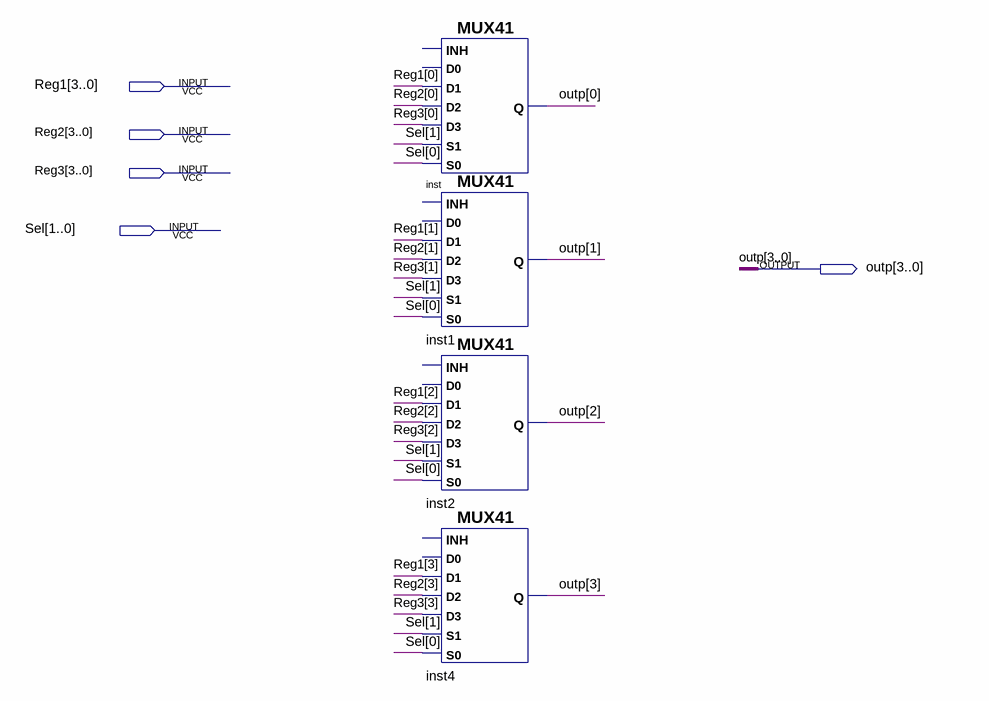
[diagram p0: schematic sheet]
// Quartus schematic mux.bdf as structural Verilog: 4 symbols, 5 pins
module mux (
  input  [3:0] Reg1,
  input  [3:0] Reg2,
  input  [3:0] Reg3,
  input  [1:0] Sel,
  output [3:0] outp
);

  MUX41 inst (.S0(Sel[0]), .D2(Reg2[0]), .S1(Sel[1]), .D3(Reg3[0]), .D1(Reg1[0]), .Q(outp[0]));  // open: D0, INH
  MUX41 inst1 (.S0(Sel[0]), .D2(Reg2[1]), .S1(Sel[1]), .D3(Reg3[1]), .D1(Reg1[1]), .Q(outp[1]));  // open: D0, INH
  MUX41 inst2 (.S0(Sel[0]), .D2(Reg2[2]), .S1(Sel[1]), .D3(Reg3[2]), .D1(Reg1[2]), .Q(outp[2]));  // open: D0, INH
  MUX41 inst4 (.S0(Sel[0]), .D2(Reg2[3]), .S1(Sel[1]), .D3(Reg3[3]), .D1(Reg1[3]), .Q(outp[3]));  // open: D0, INH
endmodule
